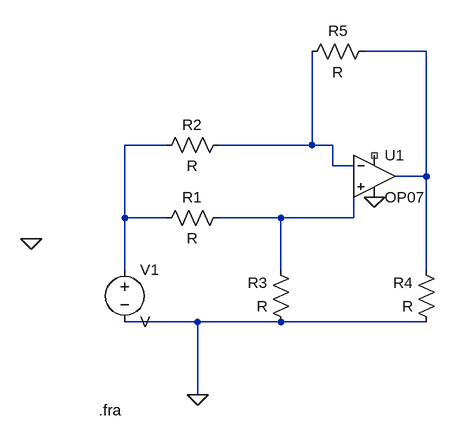
[diagram p0: schematic ethanfirsttry.asc]
ethanfirsttry.asc, the LTspice schematic file:
Version 4
SHEET 1 880 680
WIRE 608 -288 512 -288
WIRE 208 -144 144 -144
WIRE 432 -144 432 -288
WIRE 432 -144 288 -144
WIRE 464 -144 432 -144
WIRE 464 -112 464 -144
WIRE 496 -112 464 -112
WIRE 608 -96 608 -288
WIRE 608 -96 560 -96
WIRE 144 -32 144 -144
WIRE 208 -32 144 -32
WIRE 384 -32 288 -32
WIRE 496 -32 496 -80
WIRE 496 -32 384 -32
WIRE 144 48 144 -32
WIRE 384 48 384 -32
WIRE 608 48 608 -96
WIRE 256 128 144 128
WIRE 384 128 256 128
WIRE 608 128 384 128
WIRE 256 240 256 128
FLAG 256 240 0
FLAG 528 -64 0
FLAG 0 0 0
SYMBOL voltage 144 32 R0
SYMATTR InstName V1
SYMBOL res 304 -48 R90
WINDOW 0 0 56 VBottom 2
WINDOW 3 32 56 VTop 2
SYMATTR InstName R1
SYMBOL res 304 -160 R90
WINDOW 0 0 56 VBottom 2
WINDOW 3 32 56 VTop 2
SYMATTR InstName R2
SYMBOL res 400 144 R180
WINDOW 0 36 76 Left 2
WINDOW 3 36 40 Left 2
SYMATTR InstName R3
SYMBOL res 624 144 R180
WINDOW 0 36 76 Left 2
WINDOW 3 36 40 Left 2
SYMATTR InstName R4
SYMBOL res 416 -272 R270
WINDOW 0 32 56 VTop 2
WINDOW 3 0 56 VBottom 2
SYMATTR InstName R5
SYMBOL OpAmps\\OP07 528 -160 R0
SYMATTR InstName U1
TEXT 104 264 Left 2 !.fra

The netlist it stands for:
* ethanfirsttry.asc
V1 N002 0 V
R1 N004 N002 R
R2 N003 N002 R
R3 0 N004 R
R4 0 N001 R
R5 N003 N001 R
XU1 N004 N003 NC_01 0 N001 LT1001  ; OP07, pins In+ In- V+ V- OUT
.fra
.lib LTC.lib
.backanno
.end